# Altium project radFET-EM1.PrjPcb
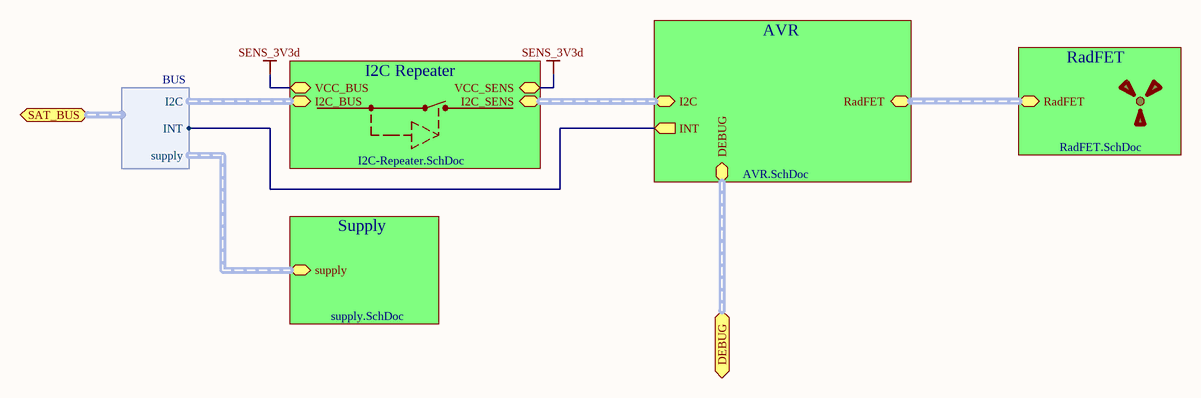
[diagram p0: top.SchDoc]
8 sheets, 61 parts. Net scope: hierarchical (ports join the sheet entries above them; power ports are global).
Board file: pcb.PcbDoc
Sheets:
  top.SchDoc
    AVR = AVR.SchDoc
    I2C Repeater = I2C-Repeater.SchDoc
    RadFET = RadFET.SchDoc
      Radfet Supply = radfet_supply.SchDoc
      ADC = ADC.SchDoc
      Channel selector = mux.SchDoc
      SENSOR = sensor.SchDoc

## Sheet top.SchDoc
size A4

### Sub-sheets
AVR = AVR.SchDoc: I2C (harness I2C), RadFET (harness RadFET), DEBUG (harness DEBUG), INT (out)
I2C Repeater = I2C-Repeater.SchDoc: I2C_BUS (harness I2C), VCC_SENS, VCC_BUS, I2C_SENS (harness I2C)
RadFET = RadFET.SchDoc: RadFET (harness RadFET)
Supply = supply.SchDoc (file not in this document): supply (harness supply)

### Ports
DEBUG, SAT_BUS (harness BUS)

### Harnesses
BUS: I2C, supply, INT

### Nets
SENS_3V3d: sheet I2C Repeater/VCC_SENS, sheet I2C Repeater/VCC_BUS
INT: sheet AVR/INT, port SAT_BUS.INT

### Buses and harness runs
harness port DEBUG = sheet AVR/DEBUG
harness sheet AVR/I2C = sheet I2C Repeater/I2C_SENS
harness sheet AVR/RadFET = sheet RadFET/RadFET

### Notes on the sheet
- Title:
- Project:
- Author:
- Model:
- Document Number:
- Checked by:
- Rev:
- Date:
- Approved by:
- Sheet:
- of
- File name:

## Sheet AVR.SchDoc: Gyroscopes Buffer
size A3; CheckedBy: (not checked); Author: P. Kuligowski
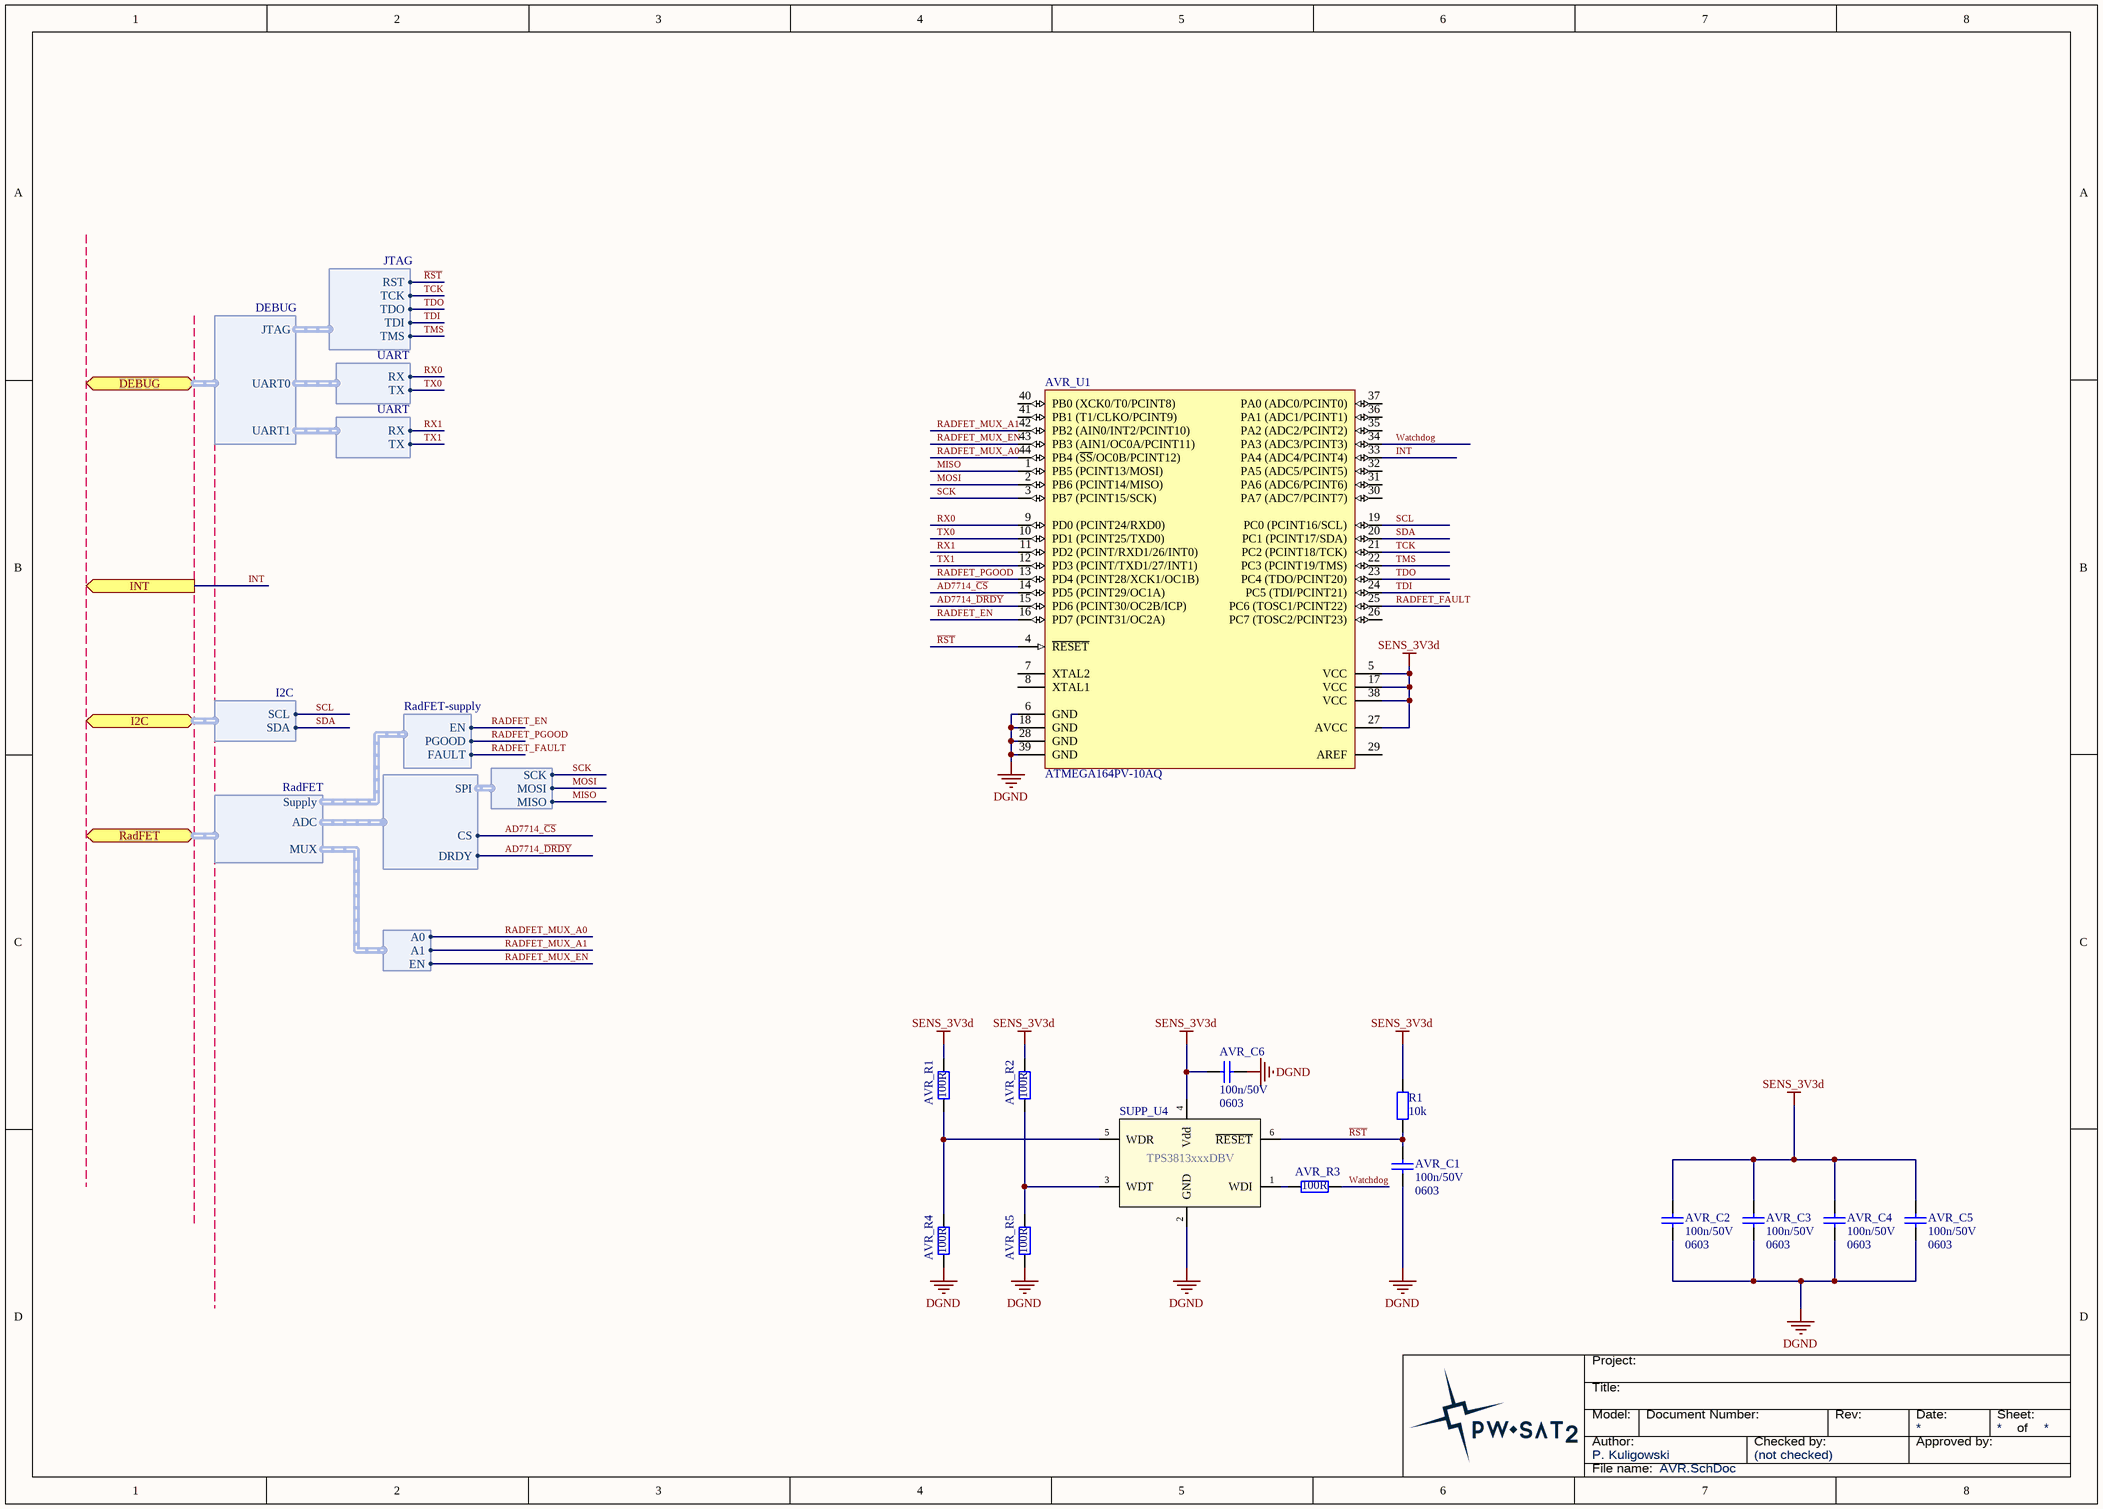
[diagram p1: AVR.SchDoc]

### Parts
AVR_C1  Package: 0603  [SMD_Capacitor_0603]  (hidden comment: 100n/50V)
AVR_C2  Package: 0603  [SMD_Capacitor_0603]  (hidden comment: 100n/50V)
AVR_C3  Package: 0603  [SMD_Capacitor_0603]  (hidden comment: 100n/50V)
AVR_C4  Package: 0603  [SMD_Capacitor_0603]  (hidden comment: 100n/50V)
AVR_C5  Package: 0603  [SMD_Capacitor_0603]  (hidden comment: 100n/50V)
AVR_C6  Package: 0603  [SMD_Capacitor_0603]  (hidden comment: 100n/50V)
AVR_R1  100R  [SMD_Resistor_0603]
AVR_R2  100R  [SMD_Resistor_0603]
AVR_R3  100R  [SMD_Resistor_0603]
AVR_R4  100R  [SMD_Resistor_0603]
AVR_R5  100R  [SMD_Resistor_0603]
AVR_U1  ATMEGA164PV-10AQ  [TQFP-44]
R1  10k  [SMD_Resistor_0603]
SUPP_U4  TPS3813xxxDBV  [SOT23-6]

### Ports
DEBUG (harness DEBUG), I2C (harness I2C), INT (out), RadFET (harness RadFET)

### Harnesses
ADC_DIGITAL: DRDY, CS, SPI
ADG709_MUX: A0, A1, EN
SPI: SCK, MOSI, MISO
I2C: SDA, SCL
DEBUG: JTAG, UART0, UART1
JTAG: RST, TCK, TDO, TDI, TMS
UART: RX, TX
RadFET: ADC, MUX, Supply
RadFET-supply: EN, PGOOD, FAULT

### Nets
DGND: AVR_C1.2 AVR_C2.2 AVR_C3.2 AVR_C4.2 AVR_C5.2 AVR_C6.2 AVR_R4.2 AVR_R5.2 AVR_U1.6(GND) AVR_U1.18(GND) AVR_U1.28(GND) AVR_U1.39(GND) SUPP_U4.2(GND)
SENS_3V3d: AVR_C2.1 AVR_C3.1 AVR_C4.1 AVR_C5.1 AVR_C6.1 AVR_R1.1 AVR_R2.1 AVR_U1.5(VCC) AVR_U1.17(VCC) AVR_U1.27(AVCC) AVR_U1.38(VCC) R1.1 SUPP_U4.4(Vdd)
AD7714_~{CS}: AVR_U1.14(PD5_(PCINT29/OC1A)) ; harness ADC_DIGITAL.CS
AD7714_~{DRDY}: AVR_U1.15(PD6_(PCINT30/OC2B/ICP)) ; harness ADC_DIGITAL.DRDY
INT: AVR_U1.33(PA4_(ADC4/PCINT4)) ; port INT
MISO: AVR_U1.1(PB5_(PCINT13/MOSI)) ; harness SPI.MISO
MOSI: AVR_U1.2(PB6_(PCINT14/MISO)) ; harness SPI.MOSI
~{RST}: AVR_C1.1 AVR_U1.4(~{RESET}) R1.2 SUPP_U4.6(~{RESET}) ; harness JTAG.RST
RADFET_EN: AVR_U1.16(PD7_(PCINT31/OC2A)) ; harness RadFET-supply.EN
RADFET_FAULT: AVR_U1.25(PC6_(TOSC1/PCINT22)) ; harness RadFET-supply.FAULT
RADFET_MUX_A0: AVR_U1.44(PB4_(~{SS}/OC0B/PCINT12)) ; harness ADG709_MUX.A0
RADFET_MUX_A1: AVR_U1.42(PB2_(AIN0/INT2/PCINT10)) ; harness ADG709_MUX.A1
RADFET_MUX_EN: AVR_U1.43(PB3_(AIN1/OC0A/PCINT11)) ; harness ADG709_MUX.EN
RADFET_PGOOD: AVR_U1.13(PD4_(PCINT28/XCK1/OC1B)) ; harness RadFET-supply.PGOOD
RX0: AVR_U1.9(PD0_(PCINT24/RXD0)) ; harness UART.RX
RX1: AVR_U1.11(PD2_(PCINT/RXD1/26/INT0)) ; harness UART.RX
SCK: AVR_U1.3(PB7_(PCINT15/SCK)) ; harness SPI.SCK  [project net MSCK]
SCL: AVR_U1.19(PC0_(PCINT16/SCL)) ; port I2C.SCL
SDA: AVR_U1.20(PC1_(PCINT17/SDA)) ; port I2C.SDA
TCK: AVR_U1.21(PC2_(PCINT18/TCK)) ; harness JTAG.TCK
TDI: AVR_U1.24(PC5_(TDI/PCINT21)) ; harness JTAG.TDI
TDO: AVR_U1.23(PC4_(TDO/PCINT20)) ; harness JTAG.TDO
TMS: AVR_U1.22(PC3_(PCINT19/TMS)) ; harness JTAG.TMS
TX0: AVR_U1.10(PD1_(PCINT25/TXD0)) ; harness UART.TX
TX1: AVR_U1.12(PD3_(PCINT/TXD1/27/INT1)) ; harness UART.TX
Watchdog: AVR_R3.2 AVR_U1.34(PA3_(ADC3/PCINT3))
NetAVR_R1_2: AVR_R1.2 AVR_R4.1 SUPP_U4.5(WDR)
NetAVR_R2_2: AVR_R2.2 AVR_R5.1 SUPP_U4.3(WDT)
NetAVR_R3_1: AVR_R3.1 SUPP_U4.1(WDI)

Not connected (* = marked no-connect by the designer): AVR_U1 7(XTAL2) 8(XTAL1) 26(PC7_(TOSC2/PCINT23)) 29(AREF) 30(PA7_(ADC7/PCINT7)) 31(PA6_(ADC6/PCINT6)) 32(PA5_(ADC5/PCINT5)) 35(PA2_(ADC2/PCINT2)) 36(PA1_(ADC1/PCINT1)) 37(PA0_(ADC0/PCINT0)) 40(PB0_(XCK0/T0/PCINT8)) 41(PB1_(T1/CLKO/PCINT9))

### Notes on the sheet
- Title:
- Project:
- Author:
- Model:
- Document Number:
- Checked by:
- Rev:
- Date:
- Approved by:
- Sheet:
- of
- File name:

### Library data of the parts
AVR_C1-AVR_C6 = Cer_C0603T104K5RALTU: Ceramic Cap Kemet COTS 100n/50V X7R 0603; Manufacturer: Kemet; ManufacturerPartNumber: C0603T104K5RALTU; Value: 100n/50V
AVR_R1-AVR_R5 = Res: Value: 100R; Package: 0603
AVR_U1 = ATMEGA164PV-10AQ: General-purpose microcontroller; Value: ATMEGA164PV-10AQ
R1 = CRCW060310K0FKxxxx: 10k/1% Vishay CRCW 0603 Resistor. 100mW, 100ppm, 75V.; Manufacturer: Vishay; ManufacturerPartNumber: CRCW060310K0FKxxxx; Value: 10k; Package: 0603
SUPP_U4 = TPS3813xxxDBV: Processor Supervisory Circuits with Window-Watchdog.; Manufacturer: Texas Instruments; Value: TPS3813xxxDBV

## Sheet I2C-Repeater.SchDoc: I2C Repeater for RadFET
size A4; CheckedBy: (not checked); Author: P. Kuligowski
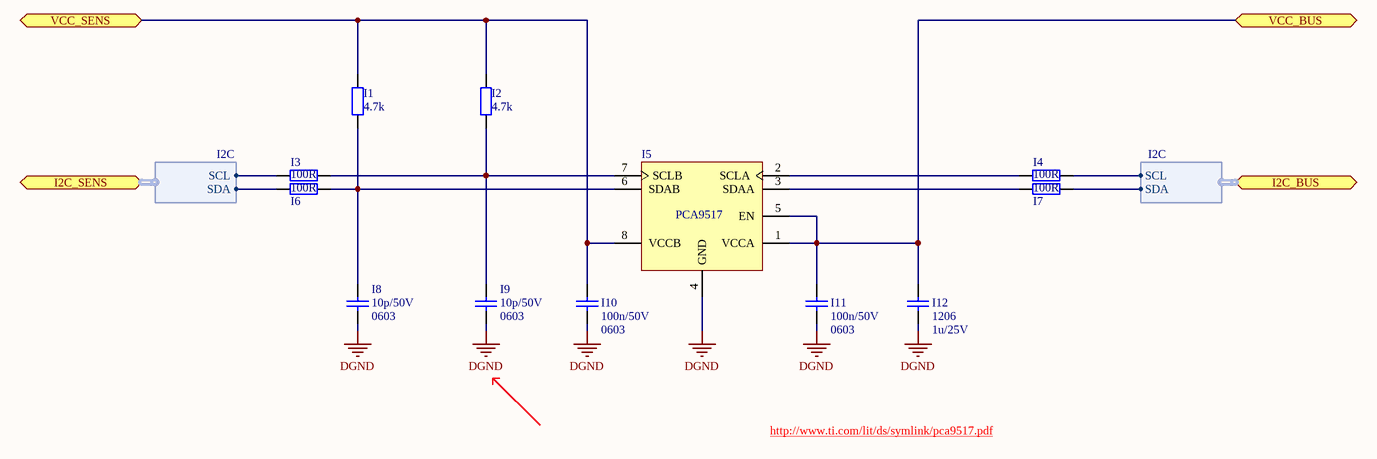
[diagram p2: I2C-Repeater.SchDoc]

### Parts
I1  4.7k  [SMD_Resistor_0603]
I2  4.7k  [SMD_Resistor_0603]
I3  100R  [SMD_Resistor_0603]
I4  100R  [SMD_Resistor_0603]
I5  PCA9517  [TSSOP8_L]
I6  100R  [SMD_Resistor_0603]
I7  100R  [SMD_Resistor_0603]
I8  Package: 0603  [SMD_Capacitor_0603]  (hidden comment: 10p/50V)
I9  Package: 0603  [SMD_Capacitor_0603]  (hidden comment: 10p/50V)
I10  Package: 0603  [SMD_Capacitor_0603]  (hidden comment: 100n/50V)
I11  Package: 0603  [SMD_Capacitor_0603]  (hidden comment: 100n/50V)
I12  Package: 1206  [SMD_Capacitor_1206]  (hidden comment: 1u/25V)

### Ports
I2C_BUS (harness I2C), I2C_SENS (harness I2C), VCC_BUS, VCC_SENS

### Harnesses
I2C: SDA, SCL

### Nets
DGND: I5.4(GND) I8.2 I9.2 I10.1 I11.1 I12.1
SENS_3V3d: I1.2 I2.2 I5.1(VCCA) I5.5(EN) I5.8(VCCB) I10.2 I11.2 I12.2 ; port VCC_BUS, port VCC_SENS
SCL: I3.1 ; port I2C_SENS.SCL
SDA: I6.1 ; port I2C_SENS.SDA
NetI1_1: I1.1 I5.6(SDAB) I6.2 I8.1
NetI2_1: I2.1 I3.2 I5.7(SCLB) I9.1
NetI4_1: I4.1 ; port I2C_BUS.SCL
NetI4_2: I4.2 I5.2(SCLA)
NetI5_3: I5.3(SDAA) I7.2
NetI7_1: I7.1 ; port I2C_BUS.SDA

### Notes on the sheet
- http://www.ti.com/lit/ds/symlink/pca9517.pdf
- Title:
- Project:
- Author:
- Model:
- Document Number:
- Checked by:
- Rev:
- Date:
- Approved by:
- Sheet:
- of
- File name:

### Library data of the parts
I1-I4 I6 I7 = Res: Package: 0603
  I1 I2: Value: 4.7k
  I3 I4 I6 I7: Value: 100R
I5 = PCA9517: Level-Translating I2C Bus Repeater; Manufacturer: Texas Instruments; ManufacturerPartNumber: PCA9517
I8 I9 = Cer_GCM1885C1H100JA16D: Ceramic Cap Murata Automotive 10p/50V C0G 0603; Manufacturer: Murata; ManufacturerPartNumber: GCM1885C1H100JA16D; Value: 10p/50V
I10 I11 = Cer_C0603T104K5RALTU: Ceramic Cap Kemet COTS 100n/50V X7R 0603; Manufacturer: Kemet; ManufacturerPartNumber: C0603T104K5RALTU; Value: 100n/50V
I12 = Cer_C1206T105K3RALTU: Ceramic Cap Kemet COTS 1u/25V X7R 1206; ManufacturerPartNumber: C1206T105K3RALTU; Manufacturer: Kemet; Value: 1u/25V

## Sheet RadFET.SchDoc: RadFET
size A4
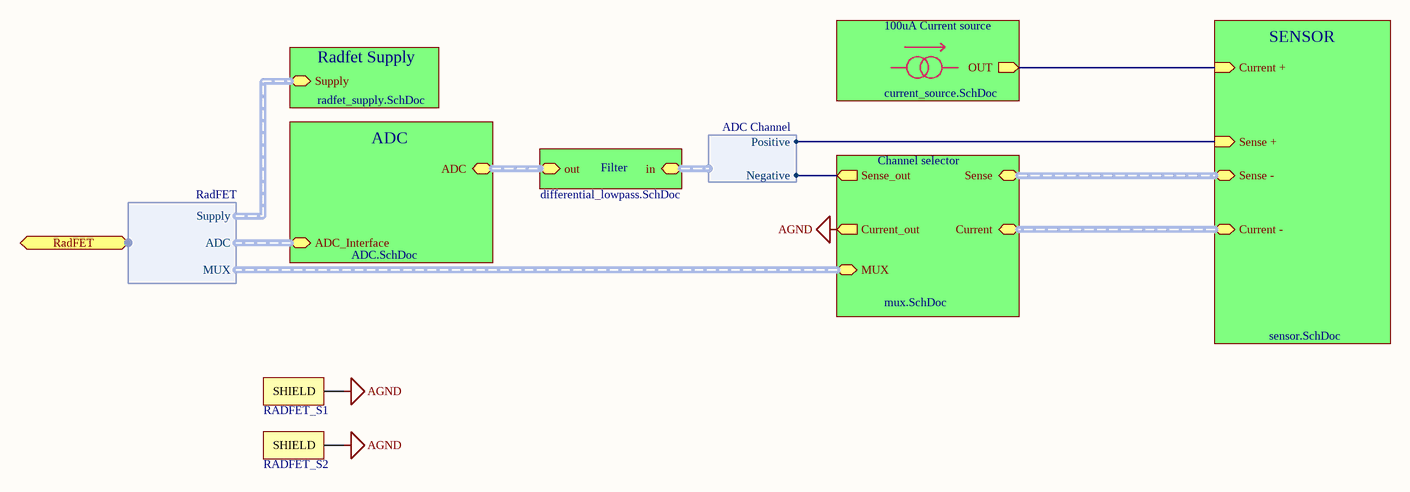
[diagram p3: RadFET.SchDoc]

### Parts
RADFET_S1  BMI-S-203-F  [BMI-S-203-F_NO3D]  (value not drawn)
RADFET_S2  BMI-S-203-F  [BMI-S-203-F_NO3D]  (value not drawn)

### Sub-sheets
100uA Current source = current_source.SchDoc (file not in this document): OUT (out)
ADC = ADC.SchDoc: ADC (harness ADC Channel), ADC_Interface (harness ADC_DIGITAL)
Channel selector = mux.SchDoc: Sense_out (out), Sense (harness ADG709_MUX_CH), Current (harness ADG709_MUX_CH), MUX (harness ADG709_MUX), Current_out (out)
Filter = differential_lowpass.SchDoc (file not in this document): in (harness ADC Channel), out (harness ADC Channel)
Radfet Supply = radfet_supply.SchDoc: Supply (harness RadFET-supply)
SENSOR = sensor.SchDoc: Sense + (in), Current + (in), Current - (harness ADG709_MUX_CH), Sense - (harness ADG709_MUX_CH)

### Ports
RadFET (harness RadFET)

### Harnesses
RadFET: ADC, MUX, Supply
ADC Channel: Positive, Negative

### Nets
AGND: RADFET_S1.0(SHIELD) RADFET_S2.0(SHIELD) ; sheet Channel selector/Current_out
Current +: sheet 100uA Current source/OUT, sheet SENSOR/Current +
Sense +: sheet SENSOR/Sense +, sheet Filter/in.Positive
Sense_out: sheet Channel selector/Sense_out, sheet Filter/in.Negative

### Buses and harness runs
harness sheet ADC/ADC = sheet Filter/out
harness sheet Channel selector/Current = sheet SENSOR/Current -
harness sheet Channel selector/Sense = sheet SENSOR/Sense -

### Notes on the sheet
- Title:
- Project:
- Author:
- Model:
- Document Number:
- Checked by:
- Rev:
- Date:
- Approved by:
- Sheet:
- of
- File name:

### Library data of the parts
RADFET_S1 RADFET_S2 = BMI-S-203-F: STANDARD SURFACE MOUNT SHIELD TWO-PIECE 26.21x26.21x5.08mm

## Sheet radfet_supply.SchDoc: Local Supply
size A3; CheckedBy: (not checked); Author: P. Kuligowski
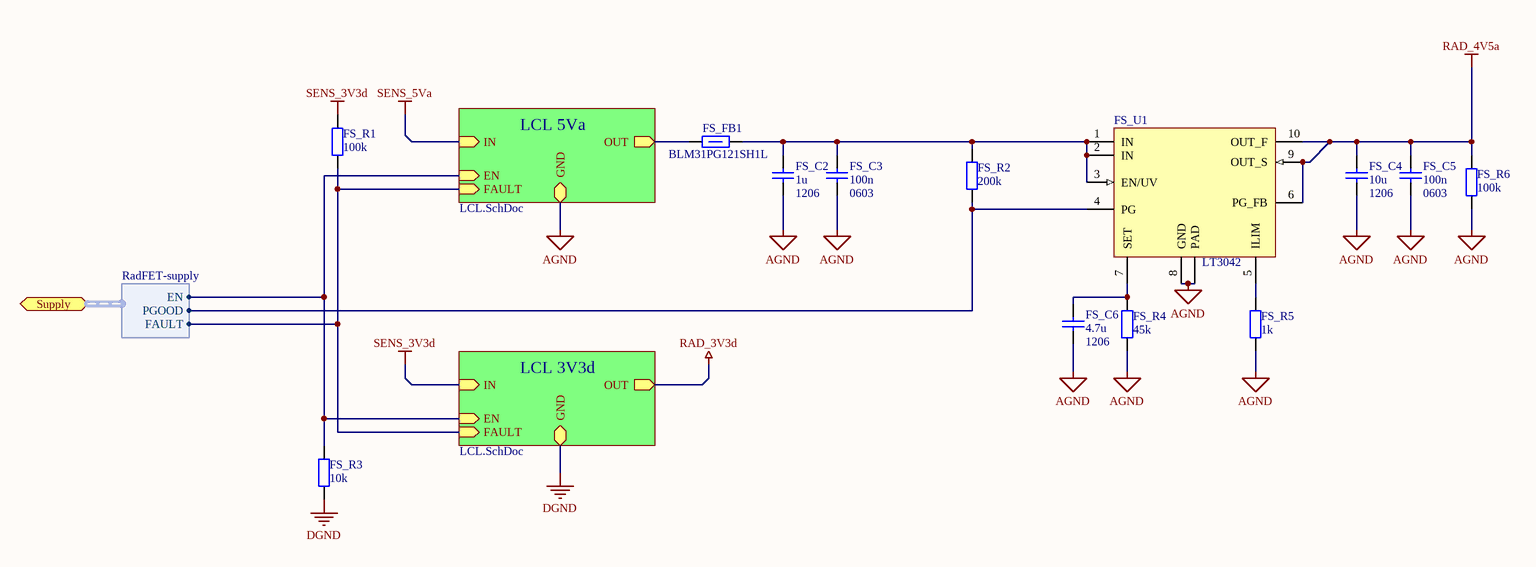
[diagram p4: radfet_supply.SchDoc]

### Parts
FS_C2  value 1u  Package: 1206  [SMD_Capacitor_1206]  (hidden comment: Cap)
FS_C3  value 100n  Package: 0603  [SMD_Capacitor_0603]  (hidden comment: Cap)
FS_C4  value 10u  Package: 1206  [SMD_Capacitor_1206]  (hidden comment: Cap)
FS_C5  value 100n  Package: 0603  [SMD_Capacitor_0603]  (hidden comment: Cap)
FS_C6  value 4.7u  Package: 1206  [SMD_Capacitor_1206]  (hidden comment: Cap)
FS_FB1  120R/100MHz  [SMD_FerriteBead_1206]  (value not drawn)
FS_R1  100k  [SMD_Resistor_0603]
FS_R2  200k  [SMD_Resistor_0603]
FS_R3  10k  [SMD_Resistor_0603]
FS_R4  45k  [SMD_Resistor_0603]
FS_R5  1k  [SMD_Resistor_0603]
FS_R6  100k  [SMD_Resistor_0603]
FS_U1  LT3042  [MSOP-10-M-thermal-pad]

### Sub-sheets
LCL 3V3d = LCL.SchDoc (file not in this document): GND, IN (in), EN (in), OUT (out), FAULT (in)
LCL 5Va = LCL.SchDoc (file not in this document): GND, IN (in), EN (in), OUT (out), FAULT (in)

### Ports
Supply (harness RadFET-supply)

### Harnesses
RadFET-supply: EN, PGOOD, FAULT

### Nets
AGND: FS_C2.2 FS_C3.2 FS_C4.2 FS_C5.2 FS_C6.2 FS_R4.1 FS_R5.1 FS_R6.1 FS_U1.8(GND) FS_U1.11(PAD) ; sheet LCL 5Va/GND
DGND: FS_R3.1 ; sheet LCL 3V3d/GND
RAD_4V5a: FS_C4.1 FS_C5.1 FS_R6.2 FS_U1.6(PG_FB) FS_U1.9(OUT_S) FS_U1.10(OUT_F)
SENS_3V3d: FS_R1.2 ; sheet LCL 3V3d/IN
SENS_5Va: sheet LCL 5Va/IN
RADFET_EN: FS_R3.2 ; sheet LCL 5Va/EN, sheet LCL 3V3d/EN, port Supply.EN
RADFET_FAULT: FS_R1.1 ; sheet LCL 5Va/FAULT, sheet LCL 3V3d/FAULT, port Supply.FAULT
RADFET_PGOOD: FS_R2.2 FS_U1.4(PG) ; port Supply.PGOOD
NetFS_C2_1: FS_C2.1 FS_C3.1 FS_FB1.1 FS_R2.1 FS_U1.1(IN) FS_U1.2(IN) FS_U1.3(EN/UV)
NetFS_C6_1: FS_C6.1 FS_R4.2 FS_U1.7(SET)
NetFS_FB1_2: FS_FB1.2 ; sheet LCL 5Va/OUT
NetFS_R5_2: FS_R5.2 FS_U1.5(ILIM)

### Notes on the sheet
- Title:
- Project:
- Author:
- Model:
- Document Number:
- Checked by:
- Rev:
- Date:
- Approved by:
- Sheet:
- of
- File name:

### Library data of the parts
FS_FB1 = BLM31PG121SH1L: Ferrite bead, 1206, 0.02HM, 3.5A.; Manufacturer: Murata; Current Rating: 3.5A; Series Resistance DC: 0.02R; Package: 1206; Value: 120R/100MHz; ManufacturerPartNumber: BLM31PG121SH1L
FS_R1-FS_R6 = Res: Package: 0603
  FS_R1 FS_R6: Value: 100k
  FS_R2: Value: 200k
  FS_R3: Value: 10k
  FS_R4: Value: 45k
  FS_R5: Value: 1k
FS_U1 = LT3042: 20V, 200mA, Ultralow Noise, Ultrahigh PSRR RF Linear Regulator; PartNumber: LT3042; ComponentLink1Description: Manufacturer URL; ComponentLink1URL: http://www.linear.com/; ComponentLink2Description: Datasheet; ComponentLink2URL: http://cds.linear.com/docs/en/datasheet/3042fa.pdf

## Sheet ADC.SchDoc: A 24-bit AD7714YRZ Analog-to-Digital Converter
size A4; PageSetup: Record=PageOptions|CenterHorizontal=True|CenterVertical=True|PrintScale=1.00|XCorrection=1.00|YCorrection=1.00|PrintKind=0|BorderSize=5000000|LeftOffset=0|BottomOffset=0|Orientation=2|PaperLength=1000|PaperWidth=1000|Scale=100|PaperSource=7|PrintQuality=-3|MediaType=1|DitherType=10|PrintScaleMode=1|PaperKind=A4|PaperIndex=9
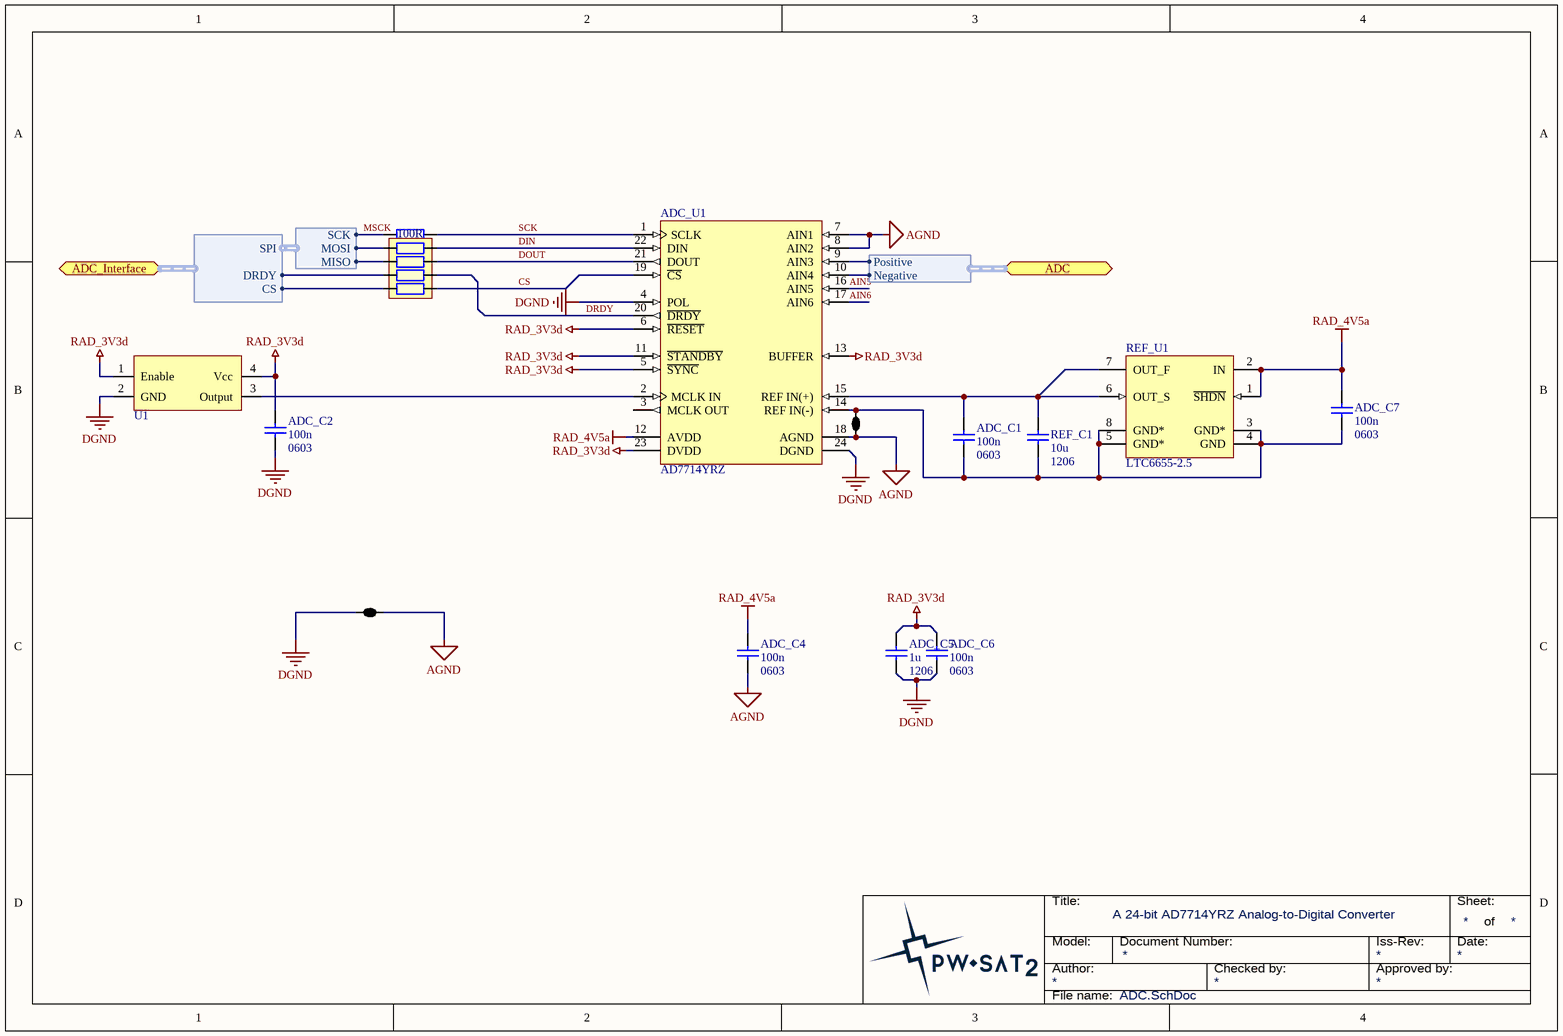
[diagram p5: ADC.SchDoc]

### Parts
ADC_C1  value 100n  Package: 0603  [SMD_Capacitor_0603]  (hidden comment: Cap)
ADC_C2  value 100n  Package: 0603  [SMD_Capacitor_0603]  (hidden comment: Cap)
ADC_C4  value 100n  Package: 0603  [SMD_Capacitor_0603]  (hidden comment: Cap)
ADC_C5  value 1u  Package: 1206  [SMD_Capacitor_1206]  (hidden comment: Cap)
ADC_C6  value 100n  Package: 0603  [SMD_Capacitor_0603]  (hidden comment: Cap)
ADC_C7  value 100n  Package: 0603  [SMD_Capacitor_0603]  (hidden comment: Cap)
ADC_J1  2 way net tie junction  [2way_LP]  (value not drawn)  (net tie, no BOM)
ADC_J2  2 way net tie junction  [2way_LP]  (value not drawn)  (net tie, no BOM)
ADC_R1  100R  [SMD_Resistor_0603]
ADC_R2  YC124-JR-072K2L  [SMD_RESISTOR_ARRAY_YC124]  (value not drawn)
ADC_U1  AD7714YRZ  [TSSOP-24-RU-24-N]
REF_C1  value 10u  Package: 1206  [SMD_Capacitor_1206]  (hidden comment: Cap)
REF_U1  LTC6655-2.5  [MSOP-8]
U1  Ceramic Crystal  [2.0 x 2.5 mm]  (value not drawn)

### Ports
ADC (harness ADC Channel), ADC_Interface (harness ADC_DIGITAL)

### Harnesses
ADC_DIGITAL: DRDY, CS, SPI
SPI: SCK, MOSI, MISO
ADC Channel: Positive, Negative

### Nets
AGND: ADC_C4.2 ADC_J1.1 ADC_J2.1 ADC_U1.7(AIN1) ADC_U1.8(AIN2) ADC_U1.18(AGND)
DGND: ADC_C2.2 ADC_C5.2 ADC_C6.2 ADC_J1.2 ADC_U1.4(POL) ADC_U1.24(DGND) U1.2(GND)
RAD_3V3d: ADC_C2.1 ADC_C5.1 ADC_C6.1 ADC_U1.5(~{SYNC}) ADC_U1.6(~{RESET}) ADC_U1.11(~{STANDBY}) ADC_U1.13(BUFFER) ADC_U1.23(DVDD) U1.1(Enable) U1.4(Vcc)
RAD_4V5a: ADC_C4.1 ADC_C7.1 ADC_U1.12(AVDD) REF_U1.1(~{SHDN}) REF_U1.2(IN)
AD7714_~{CS}: ADC_R2.5 ; port ADC_Interface.CS
AD7714_~{DRDY}: ADC_R2.6 ; port ADC_Interface.DRDY
AIN5: ADC_U1.16(AIN5)
AIN6: ADC_U1.17(AIN6)
CS: ADC_R2.4 ADC_U1.19(~{CS})
DIN: ADC_R2.1 ADC_U1.22(DIN)
DOUT: ADC_R2.2 ADC_U1.21(DOUT)
DRDY: ADC_R2.3 ADC_U1.20(~{DRDY})
MISO: ADC_R2.7 ; harness SPI.MISO
MOSI: ADC_R2.8 ; harness SPI.MOSI
MSCK: ADC_R1.1 ; harness SPI.SCK
SCK: ADC_R1.2 ADC_U1.1(SCLK)
NetADC_C1_1: ADC_C1.1 ADC_U1.15(REF_IN(+)) REF_C1.1 REF_U1.6(OUT_S) REF_U1.7(OUT_F)
NetADC_C1_2: ADC_C1.2 ADC_C7.2 ADC_J2.2 ADC_U1.14(REF_IN(-)) REF_C1.2 REF_U1.3(GND*) REF_U1.4(GND) REF_U1.5(GND*) REF_U1.8(GND*)
NetADC_U1_2: ADC_U1.2(MCLK_IN) U1.3(Output)
NetADC_U1_9: ADC_U1.9(AIN3) ; port ADC.Positive
NetADC_U1_10: ADC_U1.10(AIN4) ; port ADC.Negative

Not connected (* = marked no-connect by the designer): ADC_U1 3(MCLK_OUT)

### Notes on the sheet
- Title:
- Sheet:
- of
- Author:
- Model:
- Document Number:
- Checked by:
- Iss-Rev:
- Approved by:
- Date:
- File name:

### Library data of the parts
ADC_J1 ADC_J2 = 2way: ComponentLink1URL: http://www.edatools.cz/addons; ComponentLink1Description: Source; FootprintNote: LP=12mil, MP=40mil, HP=120mil
ADC_R1 = Res: Value: 100R; Package: 0603
ADC_R2 = YC124-JR-072K2L: RESISTOR ARRAY, 4 x 0402; URL: http://pl.farnell.com/yageo-phycomp/yc124-jr-072k2l/resistor-array-arv341-4-x-0402/dp/9235388
ADC_U1 = AD7714YRZ: 5 Channel 24-Bit Signal Conditioning Analog-to-Digital Converter with Serial, SPI Interface, 500 uA, CMOS, 3 V / 5 V, 1KSPS, -40 to +105 degC, RW-24, Pb-Free, Tube; Generic Part Number: AD7714; Manufacturer: Analog Devices; Resolution (Bits): 24; Channels: 5; Throughput Rate (SPS): 1K; Interface: Ser, SPI; DatasheetVersion: Rev.C; PackageVersion: 060706-A; PackageReference: RW-24; PackageDescription: 24-Lead Standard Small Outline Package [SOIC_W]; Supplier 1: Digi-Key; Supplier Part Number 1: AD7714YRZ-ND; Supplier 2: Farnell; Supplier Part Number 2: 1438858; Supplier 3: Newark; Supplier Part Number 3: 15P0854; Supplier 4: Newark; Supplier Part Number 4: 59K5335; Supplier 5: Mouser; Supplier Part Number 5: 584-AD7714YRZ; RoHS: Y; Packing: Tube; Mounting Technology: Surface Mount; Code_JEDEC: MS-013-AD; PartNumber: AD7714YRZ; ComponentLink1Description: Manufacturer URL; ComponentLink1URL: http://www.analog.com/en/index.html; ComponentLink2Description: Datasheet; ComponentLink2URL: http://www.analog.com/static/imported-files/data_sheets/AD7714.pdf; ComponentLink3Description: Package Specification; ComponentLink3URL: http://www.analog.com/static/imported-files/packages/33665150946139RW_24.pdf; ComponentLink4Description: Product URL; ComponentLink4URL: http://www.analog.com/en/analog-to-digital-converters/ad-converters/ad7714/products/product.html
REF_U1 = LTC6655-2.5: 0.25ppm Noise, Low Drift  Precision References; PartNumber: LTC6655-2.5; ComponentLink1Description: Manufacturer URL; ComponentLink1URL: http://www.linear.com/; ComponentLink2Description: Datasheet; ComponentLink2URL: http://cds.linear.com/docs/en/datasheet/6655fe.pdf
U1 = ISM95-3351AH-1.0000: Ceramic Crystal 1 MHz, A-Grade 25 ppm/deg

## Sheet mux.SchDoc: A 24-bit AD7714YRZ Analog-to-Digital Converter
size A4
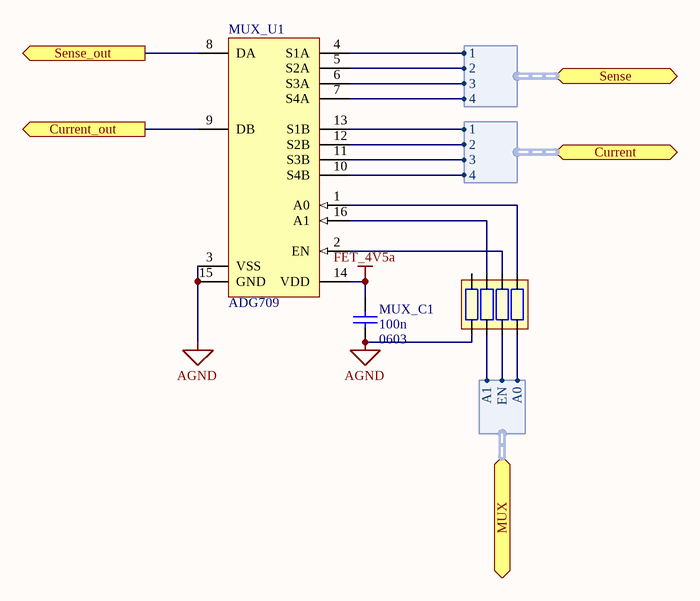
[diagram p6: mux.SchDoc]

### Parts
MUX_C1  value 100n  Package: 0603  [SMD_Capacitor_0603]  (hidden comment: Cap)
MUX_R1  YC124-JR-072K2L  [SMD_RESISTOR_ARRAY_YC124]  (value not drawn)
MUX_U1  ADG709  [TSSOP16]

### Ports
Current (harness ADG709_MUX_CH), Current_out (out), MUX (harness ADG709_MUX), Sense (harness ADG709_MUX_CH), Sense_out (out)

### Harnesses
ADG709_MUX: A0, A1, EN
ADG709_MUX_CH: 1, 2, 3, 4
ADG709_MUX_CH: 2, 3, 4, 1

### Nets
AGND: MUX_C1.2 MUX_R1.1 MUX_U1.3(VSS) MUX_U1.9(DB) MUX_U1.15(GND) ; port Current_out
FET_4V5a: MUX_C1.1 MUX_U1.14(VDD)
C_DIODE_0-2: MUX_U1.4(S1A) MUX_U1.13(S1B) ; port Sense.1, port Current.1
C_MOS_0: MUX_U1.6(S3A) MUX_U1.11(S3B) ; port Sense.3, port Current.3
C_MOS_1: MUX_U1.7(S4A) MUX_U1.10(S4B) ; port Sense.4, port Current.4
C_MOS_2: MUX_U1.5(S2A) MUX_U1.12(S2B) ; port Sense.2, port Current.2
RADFET_MUX_A0: MUX_R1.4 ; port MUX.A0
RADFET_MUX_A1: MUX_R1.2 ; port MUX.A1
RADFET_MUX_EN: MUX_R1.3 ; port MUX.EN
Sense_out: MUX_U1.8(DA) ; port Sense_out
NetMUX_R1_5: MUX_R1.5 MUX_U1.1(A0)
NetMUX_R1_6: MUX_R1.6 MUX_U1.2(EN)
NetMUX_R1_7: MUX_R1.7 MUX_U1.16(A1)

Not connected (* = marked no-connect by the designer): MUX_R1 8

### Notes on the sheet
- Title:
- Sheet:
- of
- Author:
- Model:
- Document Number:
- Checked by:
- Iss-Rev:
- Approved by:
- Date:
- File name:

### Library data of the parts
MUX_R1 = YC124-JR-072K2L: RESISTOR ARRAY, 4 x 0402; URL: http://pl.farnell.com/yageo-phycomp/yc124-jr-072k2l/resistor-array-arv341-4-x-0402/dp/9235388
MUX_U1 = ADG709: CMOS Analog 4-Channel Multiplexer; Manufacturer: Analog Devices; ManufacturerPartNumber: ADG709

## Sheet sensor.SchDoc: A 24-bit AD7714YRZ Analog-to-Digital Converter
size A4
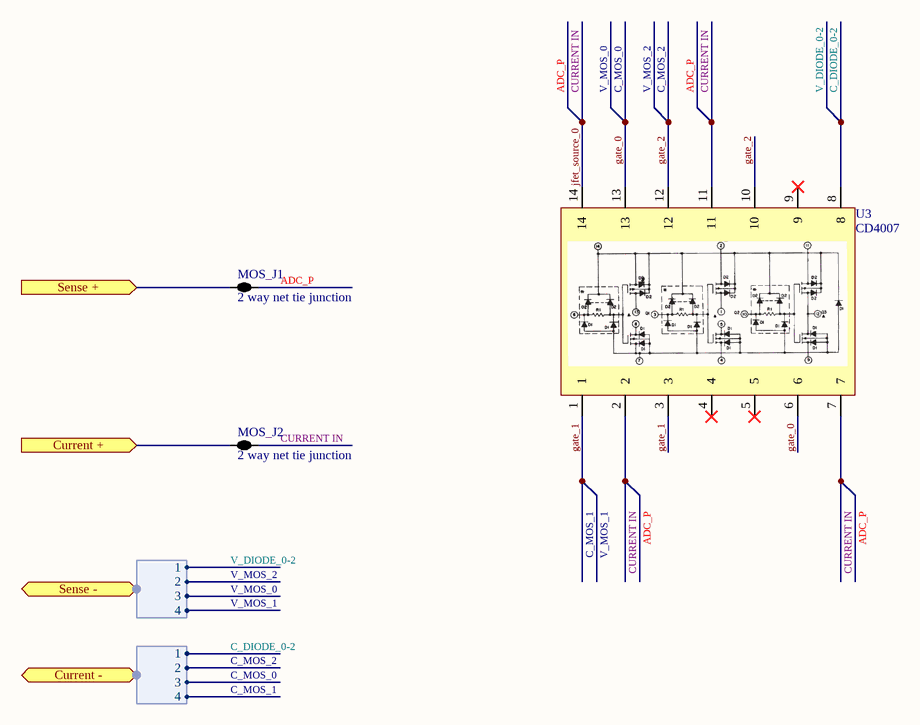
[diagram p7: sensor.SchDoc]

### Parts
MOS_J1  2 way net tie junction  [2way_LP]  (net tie, no BOM)
MOS_J2  2 way net tie junction  [2way_LP]  (net tie, no BOM)
U3  CD4007  [TSSOP14]

### Ports
Current + (in), Current - (harness ADG709_MUX_CH), Sense + (in), Sense - (harness ADG709_MUX_CH)

### Harnesses
ADG709_MUX_CH: 1, 2, 3, 4

### Nets
ADC_P: MOS_J1.2 MOS_J2.2 U3.2 U3.7 U3.11 U3.14  [also labelled CURRENT IN, jfet_source_0]
C_DIODE_0-2: U3.8 ; port Sense -.1, port Current -.1  [also labelled V_DIODE_0-2]
C_MOS_0: U3.6 U3.13 ; port Sense -.3, port Current -.3  [also labelled gate_0, V_MOS_0]
C_MOS_1: U3.1 U3.3 ; port Sense -.4, port Current -.4  [also labelled gate_1, V_MOS_1]
C_MOS_2: U3.10 U3.12 ; port Sense -.2, port Current -.2  [also labelled gate_2, V_MOS_2]
Current +: MOS_J2.1 ; port Current +
Sense +: MOS_J1.1 ; port Sense +

Not connected (* = marked no-connect by the designer): U3 4* 5* 9*

### Notes on the sheet
- Title:
- Sheet:
- of
- Author:
- Model:
- Document Number:
- Checked by:
- Iss-Rev:
- Approved by:
- Date:
- File name:

### Library data of the parts
MOS_J1 MOS_J2 = 2way: ComponentLink1URL: http://www.edatools.cz/addons; ComponentLink1Description: Source; FootprintNote: LP=12mil, MP=40mil, HP=120mil
U3 = CD4007: CMOS Dual Complementary Pair Plus Inverter; ComponentLink1URL: http://www.mouser.com/catalog/specsheets/AT45DB041D.pdf; ComponentLink1Description: Datasheet

## Nets that join several sheets
AGND: RadFET (RADFET_S1.0 RADFET_S2.0), radfet_supply (10 pins), ADC (6 pins), mux (5 pins)
DGND: AVR (13 pins), I2C-Repeater (6 pins), radfet_supply (FS_R3.1), ADC (7 pins)
RAD_4V5a: radfet_supply (6 pins), ADC (5 pins)
SENS_3V3d: AVR (13 pins), I2C-Repeater (8 pins), radfet_supply (FS_R1.2)
AD7714_~{CS}: AVR (AVR_U1.14), ADC (ADC_R2.5)
AD7714_~{DRDY}: AVR (AVR_U1.15), ADC (ADC_R2.6)
C_DIODE_0-2: mux (MUX_U1.4 MUX_U1.13), sensor (U3.8)
C_MOS_0: mux (MUX_U1.6 MUX_U1.11), sensor (U3.6 U3.13)
C_MOS_1: mux (MUX_U1.7 MUX_U1.10), sensor (U3.1 U3.3)
C_MOS_2: mux (MUX_U1.5 MUX_U1.12), sensor (U3.10 U3.12)
MISO: AVR (AVR_U1.1), ADC (ADC_R2.7)
MOSI: AVR (AVR_U1.2), ADC (ADC_R2.8)
MSCK: AVR (AVR_U1.3), ADC (ADC_R1.1)
RADFET_EN: AVR (AVR_U1.16), radfet_supply (FS_R3.2)
RADFET_FAULT: AVR (AVR_U1.25), radfet_supply (FS_R1.1)
RADFET_MUX_A0: AVR (AVR_U1.44), mux (MUX_R1.4)
RADFET_MUX_A1: AVR (AVR_U1.42), mux (MUX_R1.2)
RADFET_MUX_EN: AVR (AVR_U1.43), mux (MUX_R1.3)
RADFET_PGOOD: AVR (AVR_U1.13), radfet_supply (FS_R2.2 FS_U1.4)
SCL: AVR (AVR_U1.19), I2C-Repeater (I3.1)
SDA: AVR (AVR_U1.20), I2C-Repeater (I6.1)